# Altium schematic sheet Drive.SchDoc
size A4; SheetNumber: 2; SheetTotal: 5
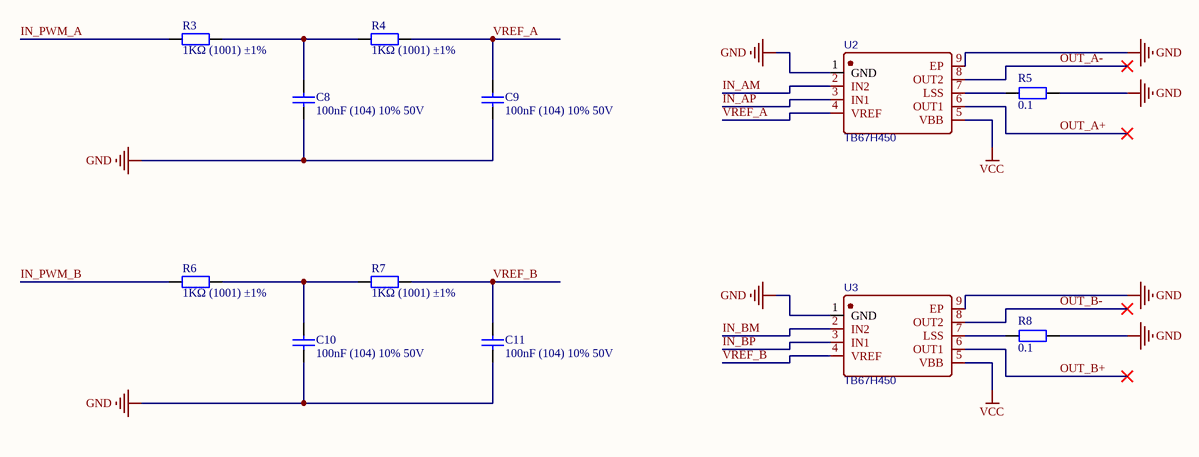
[diagram p0: Drive.SchDoc]

## Parts
C8  100nF (104) 10% 50V  [0603_C]
C9  100nF (104) 10% 50V  [0603_C]
C10  100nF (104) 10% 50V  [0603_C]
C11  100nF (104) 10% 50V  [0603_C]
R3  1KΩ (1001) ±1%  [0603_R]
R4  1KΩ (1001) ±1%  [0603_R]
R5  0.1  [R0603_M]
R6  1KΩ (1001) ±1%  [0603_R]
R7  1KΩ (1001) ±1%  [0603_R]
R8  0.1  [R0603_M]
U2  TB67H450  [SOIC-8_EP_150MIL]
U3  TB67H450  [SOIC-8_EP_150MIL]

## Nets
GND: C8.1 C9.1 C10.1 C11.1 R5.2 R8.2 U2.1(GND) U2.9(EP) U3.1(GND) U3.9(EP)
VCC: U2.5(VBB) U3.5(VBB)
IN_AM: U2.2(IN2)
IN_AP: U2.3(IN1)
IN_BM: U3.2(IN2)
IN_BP: U3.3(IN1)
IN_PWM_A: R3.1
IN_PWM_B: R6.1
OUT_A+: U2.6(OUT1)
OUT_A-: U2.8(OUT2)
OUT_B+: U3.6(OUT1)
OUT_B-: U3.8(OUT2)
VREF_A: C9.2 R4.2 U2.4(VREF)
VREF_B: C11.2 R7.2 U3.4(VREF)
NetC8_2: C8.2 R3.2 R4.1
NetC10_2: C10.2 R6.2 R7.1
NetR5_1: R5.1 U2.7(LSS)
NetR8_1: R8.1 U3.7(LSS)

## Library data of the parts
C8-C11 = 0603 100nF (104) 10% 50V: 贴片电容; ComponentLink1Description: 供应商链接; ComponentLink1URL: http://www.szlcsc.com/product/details_15331.html; Package: 0603; Supplier: LC; SuppliersPartNumber: C14663
R3 R4 R6 R7 = 0603 1KΩ (1001) 1%: 贴片电阻; ComponentLink1Description: 供应商链接; ComponentLink1URL: http://www.szlcsc.com/product/details_21904.html; Package: 0603; Supplier: LC; SuppliersPartNumber: C21190
R5 R8 = R: 贴片电阻; 3.交流分享: Q群514746572,开源更新,欢迎一起交流学习PCB设计; 4.作者声明: 旨为整合最全库集,欢迎转载,禁止商用！-冰凌猫; 5.备注说明: 该库已二次整合过网上各热销库,基本最全,无需重复搜购安装; 1.库作者: 冰凌猫; 2.库版本: v2.0 (2021.03.30); 0.0_BOM名称: 贴片电阻
U2 U3 = A4950ELJTR-T: 直流电机驱动器; BOM_Manufacturer: ALLEGRO; SMT Type: Extend; BOM_Supplier: LCSC; BOM_Manufacturer Part: A4950ELJTR-T; BOM_Supplier Part: C82404; BOM_LCSC Assembly: Yes; spicePre: U; spiceSymbolName: A4950ELJTR-T